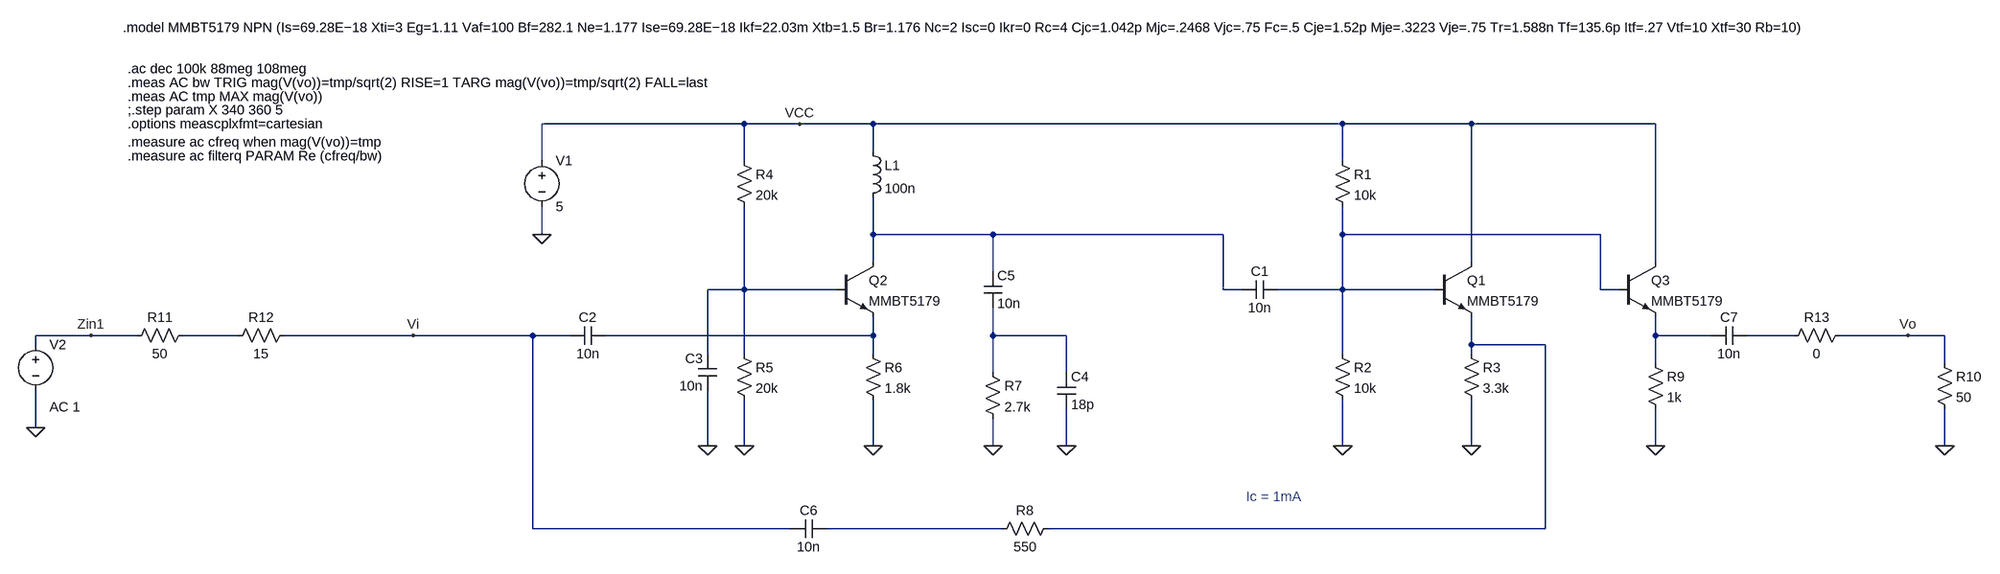
[diagram p0: schematic CC-amplifier_megawattks.asc]
CC-amplifier_megawattks.asc, the LTspice schematic file:
Version 4
SHEET 1 1188 680
WIRE -1120 -576 -1472 -576
WIRE -1024 -576 -1120 -576
WIRE -896 -576 -1024 -576
WIRE -80 -576 -896 -576
WIRE 144 -576 -80 -576
WIRE 464 -576 144 -576
WIRE -896 -528 -896 -576
WIRE -1472 -512 -1472 -576
WIRE -1120 -512 -1120 -576
WIRE -80 -512 -80 -576
WIRE -1472 -384 -1472 -432
WIRE -896 -384 -896 -448
WIRE -688 -384 -896 -384
WIRE -288 -384 -688 -384
WIRE -80 -384 -80 -432
WIRE 368 -384 -80 -384
WIRE -896 -336 -896 -384
WIRE 144 -336 144 -576
WIRE 464 -336 464 -576
WIRE -688 -320 -688 -384
WIRE -1120 -288 -1120 -432
WIRE -1120 -288 -1184 -288
WIRE -960 -288 -1120 -288
WIRE -288 -288 -288 -384
WIRE -256 -288 -288 -288
WIRE -80 -288 -80 -384
WIRE -80 -288 -192 -288
WIRE 80 -288 -80 -288
WIRE 368 -288 368 -384
WIRE 400 -288 368 -288
WIRE -2256 -208 -2352 -208
WIRE -2176 -208 -2256 -208
WIRE -2000 -208 -2096 -208
WIRE -1696 -208 -1920 -208
WIRE -1488 -208 -1696 -208
WIRE -1424 -208 -1488 -208
WIRE -896 -208 -896 -240
WIRE -896 -208 -1360 -208
WIRE -688 -208 -688 -256
WIRE -560 -208 -688 -208
WIRE 464 -208 464 -240
WIRE 560 -208 464 -208
WIRE 704 -208 624 -208
WIRE 1056 -208 784 -208
WIRE 1120 -208 1056 -208
WIRE -2352 -192 -2352 -208
WIRE 144 -192 144 -240
WIRE 272 -192 144 -192
WIRE -1184 -176 -1184 -288
WIRE -1120 -176 -1120 -288
WIRE -896 -176 -896 -208
WIRE -80 -176 -80 -288
WIRE 144 -176 144 -192
WIRE 464 -160 464 -208
WIRE 1120 -160 1120 -208
WIRE -688 -144 -688 -208
WIRE -560 -144 -560 -208
WIRE -2352 -48 -2352 -112
WIRE -1184 -16 -1184 -112
WIRE -1120 -16 -1120 -96
WIRE -896 -16 -896 -96
WIRE -688 -16 -688 -64
WIRE -560 -16 -560 -80
WIRE -80 -16 -80 -96
WIRE 144 -16 144 -96
WIRE 464 -16 464 -80
WIRE 1120 -16 1120 -80
WIRE -1488 128 -1488 -208
WIRE -1040 128 -1488 128
WIRE -672 128 -976 128
WIRE 272 128 272 -192
WIRE 272 128 -592 128
FLAG -1472 -384 0
FLAG -80 -16 0
FLAG 144 -16 0
FLAG -2352 -48 0
FLAG -2256 -208 Zin1
FLAG -1120 -16 0
FLAG -896 -16 0
FLAG -1024 -576 VCC
FLAG -1184 -16 0
FLAG -688 -16 0
FLAG -560 -16 0
FLAG 1056 -208 Vo
FLAG 464 -16 0
FLAG 1120 -16 0
FLAG -1696 -208 Vi
SYMBOL res -96 -528 R0
SYMATTR InstName R1
SYMATTR Value 10k
SYMBOL res -96 -192 R0
SYMATTR InstName R2
SYMATTR Value 10k
SYMBOL res 128 -192 R0
SYMATTR InstName R3
SYMATTR Value 3.3k
SYMBOL voltage -1472 -528 R0
WINDOW 123 0 0 Left 0
WINDOW 39 0 0 Left 0
SYMATTR InstName V1
SYMATTR Value 5
SYMBOL npn 80 -336 R0
SYMATTR InstName Q1
SYMATTR Value MMBT5179
SYMBOL cap -192 -304 R90
WINDOW 0 0 32 VBottom 2
WINDOW 3 32 32 VTop 2
SYMATTR InstName C1
SYMATTR Value 10n
SYMBOL res -1136 -528 R0
SYMATTR InstName R4
SYMATTR Value 20k
SYMBOL res -1136 -192 R0
SYMATTR InstName R5
SYMATTR Value 20k
SYMBOL res -912 -192 R0
SYMATTR InstName R6
SYMATTR Value 1.8k
SYMBOL npn -960 -336 R0
SYMATTR InstName Q2
SYMATTR Value MMBT5179
SYMBOL cap -1360 -224 R90
WINDOW 0 0 32 VBottom 2
WINDOW 3 32 32 VTop 2
SYMATTR InstName C2
SYMATTR Value 10n
SYMBOL res -704 -160 R0
SYMATTR InstName R7
SYMATTR Value 2.7k
SYMBOL voltage -2352 -208 R0
WINDOW 123 24 124 Left 2
WINDOW 39 24 152 Left 2
SYMATTR Value2 AC 1
SYMATTR InstName V2
SYMATTR Value ""
SYMBOL cap -1168 -112 R180
WINDOW 0 24 56 Left 2
WINDOW 3 24 8 Left 2
SYMATTR InstName C3
SYMATTR Value 10n
SYMBOL ind -912 -544 R0
SYMATTR InstName L1
SYMATTR Value 100n
SYMBOL cap -576 -144 R0
SYMATTR InstName C4
SYMATTR Value 18p
SYMBOL cap -704 -320 R0
SYMATTR InstName C5
SYMATTR Value 10n
SYMBOL cap -976 112 R90
WINDOW 0 0 32 VBottom 2
WINDOW 3 32 32 VTop 2
SYMATTR InstName C6
SYMATTR Value 10n
SYMBOL res -576 112 R90
WINDOW 0 0 56 VBottom 2
WINDOW 3 32 56 VTop 2
SYMATTR InstName R8
SYMATTR Value 550
SYMBOL npn 400 -336 R0
SYMATTR InstName Q3
SYMATTR Value MMBT5179
SYMBOL res 448 -176 R0
SYMATTR InstName R9
SYMATTR Value 1k
SYMBOL cap 624 -224 R90
WINDOW 0 0 32 VBottom 2
WINDOW 3 32 32 VTop 2
SYMATTR InstName C7
SYMATTR Value 10n
SYMBOL res 1104 -176 R0
SYMATTR InstName R10
SYMATTR Value 50
SYMBOL res -2080 -224 R90
WINDOW 0 0 56 VBottom 2
WINDOW 3 32 56 VTop 2
SYMATTR InstName R11
SYMATTR Value 50
SYMBOL res -1904 -224 R90
WINDOW 0 0 56 VBottom 2
WINDOW 3 32 56 VTop 2
SYMATTR InstName R12
SYMATTR Value 15
SYMBOL res 800 -224 R90
WINDOW 0 0 56 VBottom 2
WINDOW 3 32 56 VTop 2
SYMATTR InstName R13
SYMATTR Value 0
TEXT -2192 -672 Left 2 !.ac dec 100k 88meg 108meg
TEXT -248 72 Left 2 ;Ic = 1mA
TEXT -2200 -744 Left 2 !.model MMBT5179 NPN (Is=69.28E−18 Xti=3 Eg=1.11 Vaf=100 Bf=282.1 Ne=1.177 Ise=69.28E−18 Ikf=22.03m Xtb=1.5 Br=1.176 Nc=2 Isc=0 Ikr=0 Rc=4 Cjc=1.042p Mjc=.2468 Vjc=.75 Fc=.5 Cje=1.52p Mje=.3223 Vje=.75 Tr=1.588n Tf=135.6p Itf=.27 Vtf=10 Xtf=30 Rb=10)
TEXT -2192 -600 Left 2 !;.step param X 340 360 5
TEXT -2192 -624 Left 2 !.meas AC tmp MAX mag(V(vo))
TEXT -2192 -648 Left 2 !.meas AC bw TRIG mag(V(vo))=tmp/sqrt(2) RISE=1 TARG mag(V(vo))=tmp/sqrt(2) FALL=last
TEXT -2192 -576 Left 2 !.options meascplxfmt=cartesian\n.measure ac cfreq when mag(V(vo))=tmp
TEXT -2192 -520 Left 2 !.measure ac filterq PARAM Re (cfreq/bw)

The netlist it stands for:
* CC-amplifier_megawattks.asc
R1 VCC N002 10k
R2 N002 0 10k
R3 N009 0 3.3k
V1 VCC 0 5
Q1 VCC N002 N009 0 MMBT5179
C1 N002 N001 10n
R4 VCC N003 20k
R5 N003 0 20k
R6 N005 0 1.8k
Q2 N001 N003 N005 0 MMBT5179
C2 N005 Vi 10n
R7 N006 0 2.7k
V2 Zin1 0 AC 1
C3 0 N003 10n
L1 VCC N001 100n
C4 N006 0 18p
C5 N001 N006 10n
C6 N010 Vi 10n
R8 N009 N010 550
Q3 VCC N002 N007 0 MMBT5179
R9 N007 0 1k
C7 N008 N007 10n
R10 Vo 0 50
R11 N004 Zin1 50
R12 Vi N004 15
R13 Vo N008 0
.model NPN NPN
.model PNP PNP
.lib standard.bjt
.ac dec 100k 88meg 108meg
* Ic = 1mA
.model MMBT5179 NPN (Is=69.28E−18 Xti=3 Eg=1.11 Vaf=100 Bf=282.1 Ne=1.177 Ise=69.28E−18 Ikf=22.03m Xtb=1.5 Br=1.176 Nc=2 Isc=0 Ikr=0 Rc=4 Cjc=1.042p Mjc=.2468 Vjc=.75 Fc=.5 Cje=1.52p Mje=.3223 Vje=.75 Tr=1.588n Tf=135.6p Itf=.27 Vtf=10 Xtf=30 Rb=10)
;.step param X 340 360 5
.meas AC tmp MAX mag(V(vo))
.meas AC bw TRIG mag(V(vo))=tmp/sqrt(2) RISE=1 TARG mag(V(vo))=tmp/sqrt(2) FALL=last
.options meascplxfmt=cartesian
.measure ac cfreq when mag(V(vo))=tmp
.measure ac filterq PARAM Re (cfreq/bw)
.backanno
.end